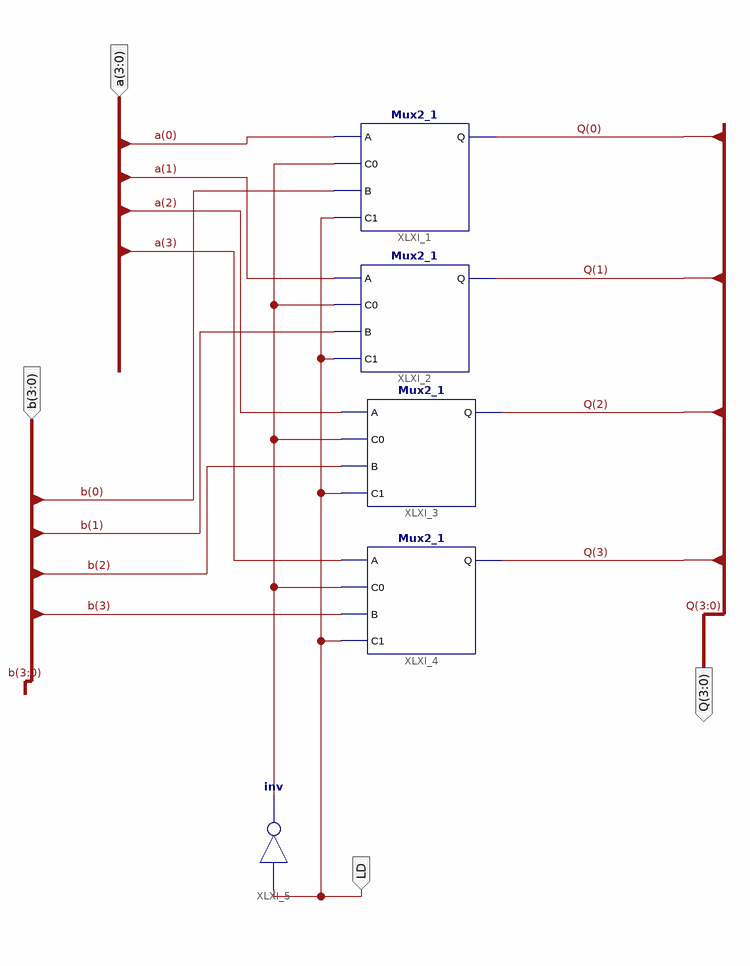
[diagram p0: schematic sheet 1]
// Xilinx ISE schematic MUX_2_4.sch (spartan3e) as structural Verilog: 5 symbols, 4 ports
module MUX_2_4 (
  input  [3:0] a,
  input  [3:0] b,
  input  LD,
  output [3:0] Q
);

  wire C0;

  Mux2_1 XLXI_1 (.A(a[0]), .B(b[0]), .C0(C0), .C1(LD), .Q(Q[0]));
  Mux2_1 XLXI_2 (.A(a[1]), .B(b[1]), .C0(C0), .C1(LD), .Q(Q[1]));
  Mux2_1 XLXI_3 (.A(a[2]), .B(b[2]), .C0(C0), .C1(LD), .Q(Q[2]));
  Mux2_1 XLXI_4 (.A(a[3]), .B(b[3]), .C0(C0), .C1(LD), .Q(Q[3]));
  not XLXI_5 (C0, LD);
endmodule
